# EAGLE design LED light with delay timer (EAGLE 6.5.0)
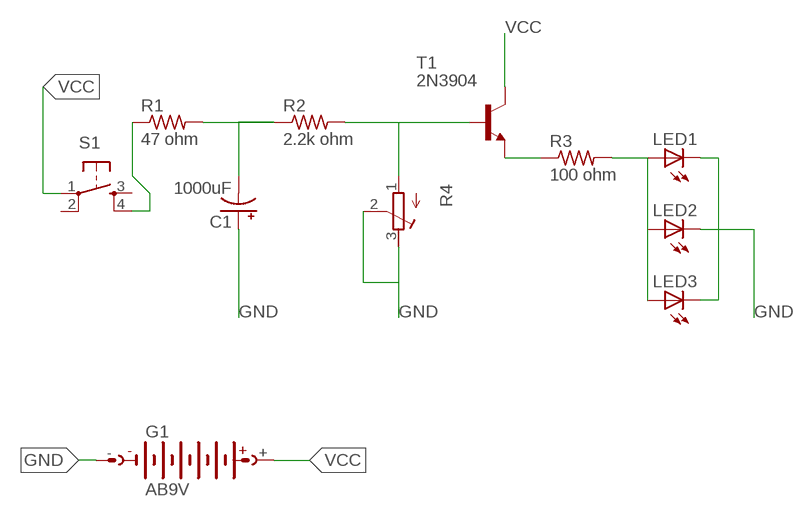
[diagram p0: schematic, sheet 1]

## Parts
C1  1000uF  CAP_POLPTH1  [CPOL-RADIAL-100UF-25V]
G1  AB9V  [AB9V]
LED1  LED5MM  [LED5MM]
LED2  LED5MM  [LED5MM]
LED3  LED5MM  [LED5MM]
R1  47 ohm  R-US_0204/7  [0204/7]
R2  2.2k ohm  R-US_0204/7  [0204/7]
R3  100 ohm  R-US_0204/7  [0204/7]
R4  R-TRIMM3339P  [RTRIM3339P]
S1  TAC_SWITCHPTH  [TACTILE-PTH]
T1  2N3904  [TO92]

## Nets
GND: C1.1(+) G1.- LED1.K(C) LED2.K(C) LED3.K(C) R4.2(S) R4.3(E)
N$1: C1.2(-) R1.2 R2.1
N$2: R2.2 R4.1(A) T1.2(B)
N$3: R1.1 S1.4
N$7: R3.1 T1.3(E)
N$8: LED1.A LED2.A LED3.A R3.2
VCC: G1.+ S1.1 T1.1(C)
Unconnected: S1.2 S1.3

## Library data of the parts
C1 = SparkFun:CAP_POL: Capacitor Polarized These are standard SMD and PTH capacitors. Normally 10uF, 47uF, and 100uF in electrolytic and tantalum varieties. Always verify the external diameter of the through hole cap, it varies with capacity, voltage, and manufacturer. The EIA devices should be standard.
G1 = battery:AB9V: 9-V BATTERY CLIP
LED1-LED3 = adafruit:LED: LED OSRAM: - CHIPLED LG R971, LG N971, LY N971, LG Q971, LY Q971, LO R971, LY R971 LH N974, LH R974 LS Q976, LO Q976, LY Q976 LO Q996 - Hyper CHIPLED LW Q18S LB Q993, LB Q99A, LB R99A - SideLED LS A670, LO A670, LY A670, LG A670, LP A670 LB A673, LV A673, LT A673, LW A673 LH A674 LY A675 LS A676, LA A676, LO A676, LY A676, LW A676 LS A679, LY A679, LG A679 - Hyper Micro SIDELED® LS Y876, LA Y876, LO Y876, LY Y876 LT Y87S - SmartLED LW L88C, LW L88S LB L89C, LB L89S, LG L890 LS L89K, LO L89K, LY L89K LS L896, LA L896, LO L896, LY L896 - TOPLED LS T670, LO T670, LY T670, LG T670, LP T670 LSG T670, LSP T670, LSY T670, LOP T670, LYG T670 LG T671, LOG T671, LSG T671 LB T673, LV T673, LT T673, LW T673 LH T674 LS T676, LA T676, LO T676, LY T676, LB T676, LH T676, LSB T676, LW T676 LB T67C, LV T67C, LT T67C, LS T67K, LO T67K, LY T67K, LW E67C LS E67B, LA E67B, LO E67B, LY E67B, LB E67C, LV E67C, LT E67C LW T67C LS T679, LY T679, LG T679 LS T770, LO T770, LY T770, LG T770, LP T770 LB T773, LV T773, LT T773, LW T773 LH T774 LS E675, LA E675, LY E675, LS T675 LS T776, LA T776, LO T776, LY T776, LB T776 LHGB T686 LT T68C, LB T68C - Hyper Mini TOPLED® LB M676 - Mini TOPLED Santana® LG M470 LS M47K, LO M47K, LY M47K Source: http://www.osram.convergy.de/
R1-R3 = adafruit:R-US_: RESISTOR, American symbol
R4 = rcl:R-TRIMM: Trimm resistor
S1 = SparkFun:TAC_SWITCH: Momentary Switch Button commonly used for reset or general input. Spark Fun Electronics SKU : COM-00097
T1 = transistor:2N3904: NPN TRANSISTOR

## Net classes
0 default: width 0.508 mm, drill 0.508 mm, clearance 0.762 mm

## Board
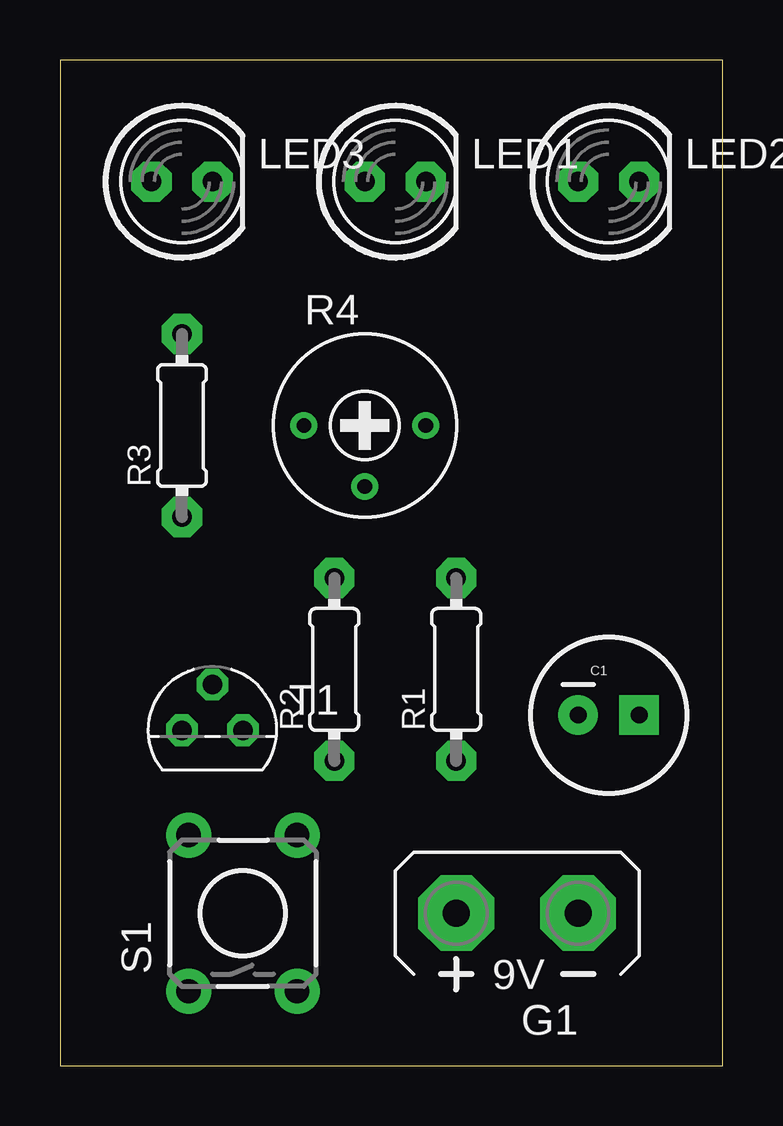
[diagram p1: board, top side]
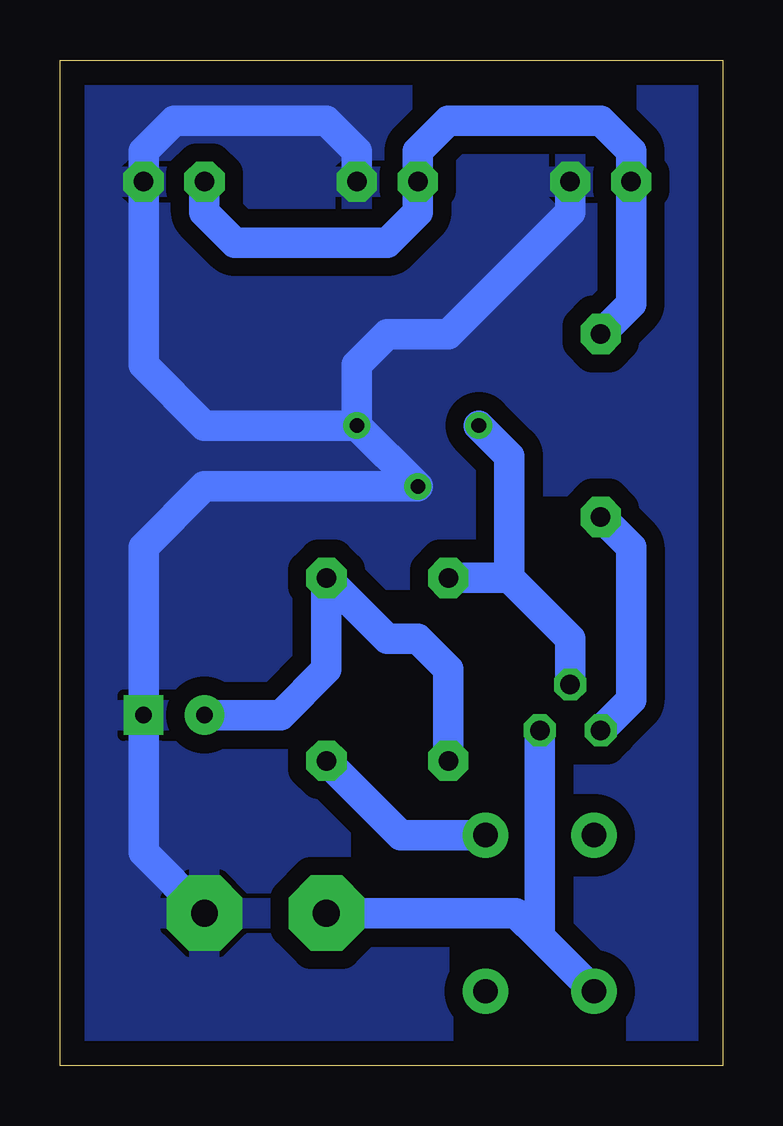
[diagram p2: board, bottom side, seen from below]

Size 27.61 x 41.9 mm. Coordinates in mm from the lower left corner, seen from the top.
Outline: 0,0 27.61,0 27.61,41.9 0,41.9 0,0
Copper layers (1*16): Top 0.035mm / dielectric 1.5mm / Bottom 0.035mm
Design rules "default *": minimum track width 10mil, minimum drill 24mil, track to track 15mil, track to pad 8mil, pad to pad 8mil, via to via 8mil, smd to smd 8mil, copper to edge 40mil, drill to drill 15mil, minimum pad ring 10mil, minimum via ring 8mil, stop-mask expansion 4mil, vias tented up to drill 0mil, thermal gap 10mil

### Footprints (pad centres in the part's own frame; a part is rotated, then mirrored left to right if it is on the bottom)
CPOL-RADIAL-100UF-25V = drill 0.7 pad 1.651 square: 1 1.27,0 | drill 0.7 pad 1.651: 2 -1.27,0
AB9V = drill 1.118 pad 3.15 octagon: + 0,2.54; - 0,-2.54
LED5MM = drill 0.813 pad 1.676 octagon: A -1.27,0; K 1.27,0
0204/7 = drill 0.813 pad 1.676 octagon: 1 -3.81,0; 2 3.81,0
RTRIM3339P = drill 0.61: 1 -2.54,0; 2 0,-2.54; 3 2.54,0
TACTILE-PTH = drill 1.016 pad 1.88: 1 -3.251,2.261; 2 3.251,2.261; 3 -3.251,-2.261; 4 3.251,-2.261
TO92 = drill 0.813 octagon: 1 1.27,0; 2 0,1.905; 3 -1.27,0

### Placement (x,y rotation side)
C1  22.86,14.61 0 top
G1  19.05,6.35 90 top
LED1  13.97,36.83 0 top
LED2  22.86,36.83 0 top
LED3  5.08,36.83 0 top
R1  16.51,16.51 90 top
R2  11.43,16.51 90 top
R3  5.08,26.67 90 top
R4  12.7,26.67 0 top
S1  7.62,6.35 90 top
T1  6.35,13.97 0 top

### Tracks (layer width: path | path; a pad name or v marks a point on that pad's centre or on a via)
GND
  Bottom 1.27: R4.3 R4.2 21.59,24.13 24.13,21.59 C1.1 24.13,8.89 G1.- | LED1.K 15.24,38.1 16.51,39.37 22.86,39.37 24.13,38.1 LED2.K 24.13,29.21 21.59,26.67 R4.3 | LED3.K 6.35,35.56 11.43,30.48 13.97,30.48 15.24,29.21 R4.3
  pour Bottom: 0,41.91 27.94,41.91 27.94,0 0,0
N$1
  Bottom 1.27: R2.1 11.43,16.51 12.7,17.78 13.97,17.78 R1.2 16.51,16.51 18.41,14.61 C1.2
N$2
  Bottom 1.27: T1.2 6.35,17.78 8.89,20.32 | 8.89,20.32 R2.2 | R4.1 8.89,25.4 8.89,20.32
N$3
  Bottom 1.27: S1.4 13.41,9.6 R1.1
N$7
  Bottom 1.27: R3.1 3.81,21.59 3.81,15.24 T1.3
N$8
  Bottom 1.27: LED2.A 21.59,35.56 20.32,34.29 13.97,34.29 12.7,35.56 LED1.A 12.7,38.1 11.43,39.37 5.08,39.37 3.81,38.1 LED3.A 3.81,31.75 R3.2
VCC
  Bottom 1.27: T1.1 7.62,5.36 | 7.62,5.36 S1.1 | G1.+ 8.61,6.35 7.62,5.36